# Altium schematic sheet Via Stitching and Shielding.SchDoc
size A4
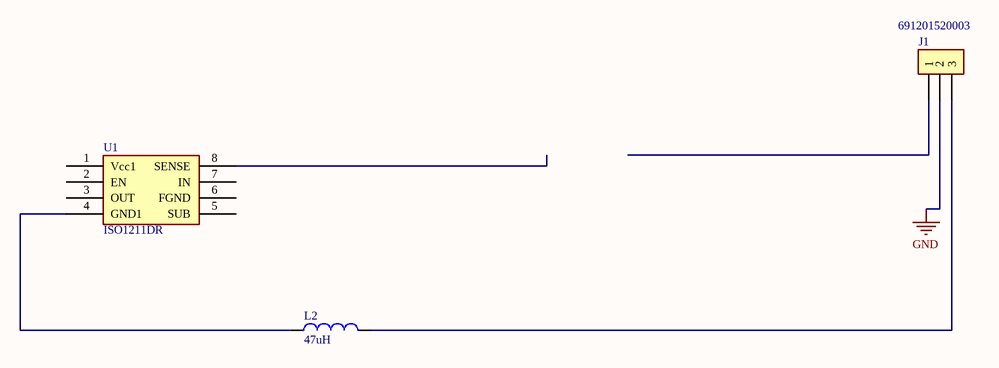
[diagram p0: Via Stitching and Shielding.SchDoc]

## Parts
J1  691201520003  [CLEMA 3X1]
L2  47uH  [IND-4.8X4.8mm]
U1  ISO1211DR  [SOIC8]

## Nets
GND: J1.2
NetJ1_3: J1.3 L2.2
NetL2_1: L2.1 U1.4(GND1)

Not connected (* = marked no-connect by the designer): J1 1; U1 1(Vcc1) 2(EN) 3(OUT) 5(SUB) 6(FGND) 7(IN) 8(SENSE)

## Library data of the parts
J1 = CLEMA 3X1 Wurth Eectronics: No. Parte: 691201520003, Pitch 5.08 mm - 45° , Wurth Eectronics; ComponentLink1Description: WR-TBL Serie 2015; ComponentLink1URL: https://www.we-online.com/catalog/en/TBL_5_08_2015_45-DEGREE_ENTRY_W_RISING_CAGE_69120152000x/?sq=691201520002&sp=https%3A%2F%2Fwww.we-online.com%2Fweb%2Fen%2Fwuerth_elektronik%2Fsearchpage.php%3Fsearch%3D691201520002
L2 = IND-47uH/800mA: FIXED IND 47UH 0.8A 270 MOHM SMD; Manufacturer: Bourns; Manufacturer Part Number: SRR4828A-470M; Core Material: Ferrite; Tolerance: 20%; Current Rating: 1.2A; Saturation Current: 470mA; Shielding: Shielded; DC Resistance (DCR): 270mR; Self Resonant Frequency: 13MHz; Test Frequency: 100kHz; Supplier 1: Mouser; Stock 1: 791; Pricing 1: 1=0.66, 10=0.588, 25=0.546, 50=0.462, 100=0.42, 250=0.394 (USD); Mount: Surface Mount; Case/Package: Nonstandard; Min Operating Temperature: -40°C; Max Operating Temperature: 150°C; Composition: Wirewound; Packaging: Cut Tape; Inductance: 47uH; Ratings: AEC-Q200; ComponentLink1URL: https://www.bourns.com/docs/Product-Datasheets/SRR4828A.pdf?src-supplier=Digi-Key; ComponentLink1Description: https://www.bourns.com/docs/Product-Datasheets/SRR4828A.pdf?src-supplier=Digi-Key; Supplier Part Number 1: 652-SRR4828A-470M
U1 = AisladorDig-ISO1211DR: 24-V to 60-V Digital Input Receivers for Digital Input Modules datasheet; Manufacturer: Texas Instruments; Number of Channels: 1; Precio: $2.03; Supplier 1: Digi-Key; Manufacturer Part Number: ISO1211DR; Stock 1: 2022; Pricing 1: 1=1.35, 10=1.203, 100=0.9381, 500=0.77498, 1000=0.61182 (USD); Mount: Surface Mount; Case/Package: SOIC; Number of Pins: 8; Min Operating Temperature: -55°C; Max Operating Temperature: 125°C; Packaging: Tape and Reel; ComponentLink1URL: http://www.ti.com/lit/ds/symlink/iso1211.pdf?src-supplier=Digi-Key; ComponentLink1Description: http://www.ti.com/lit/ds/symlink/iso1211.pdf?src-supplier=Digi-Key; Supplier Part Number 1: 296-49651-1-ND